# Altium schematic sheet EP3CE75F484.SchDoc
size A1
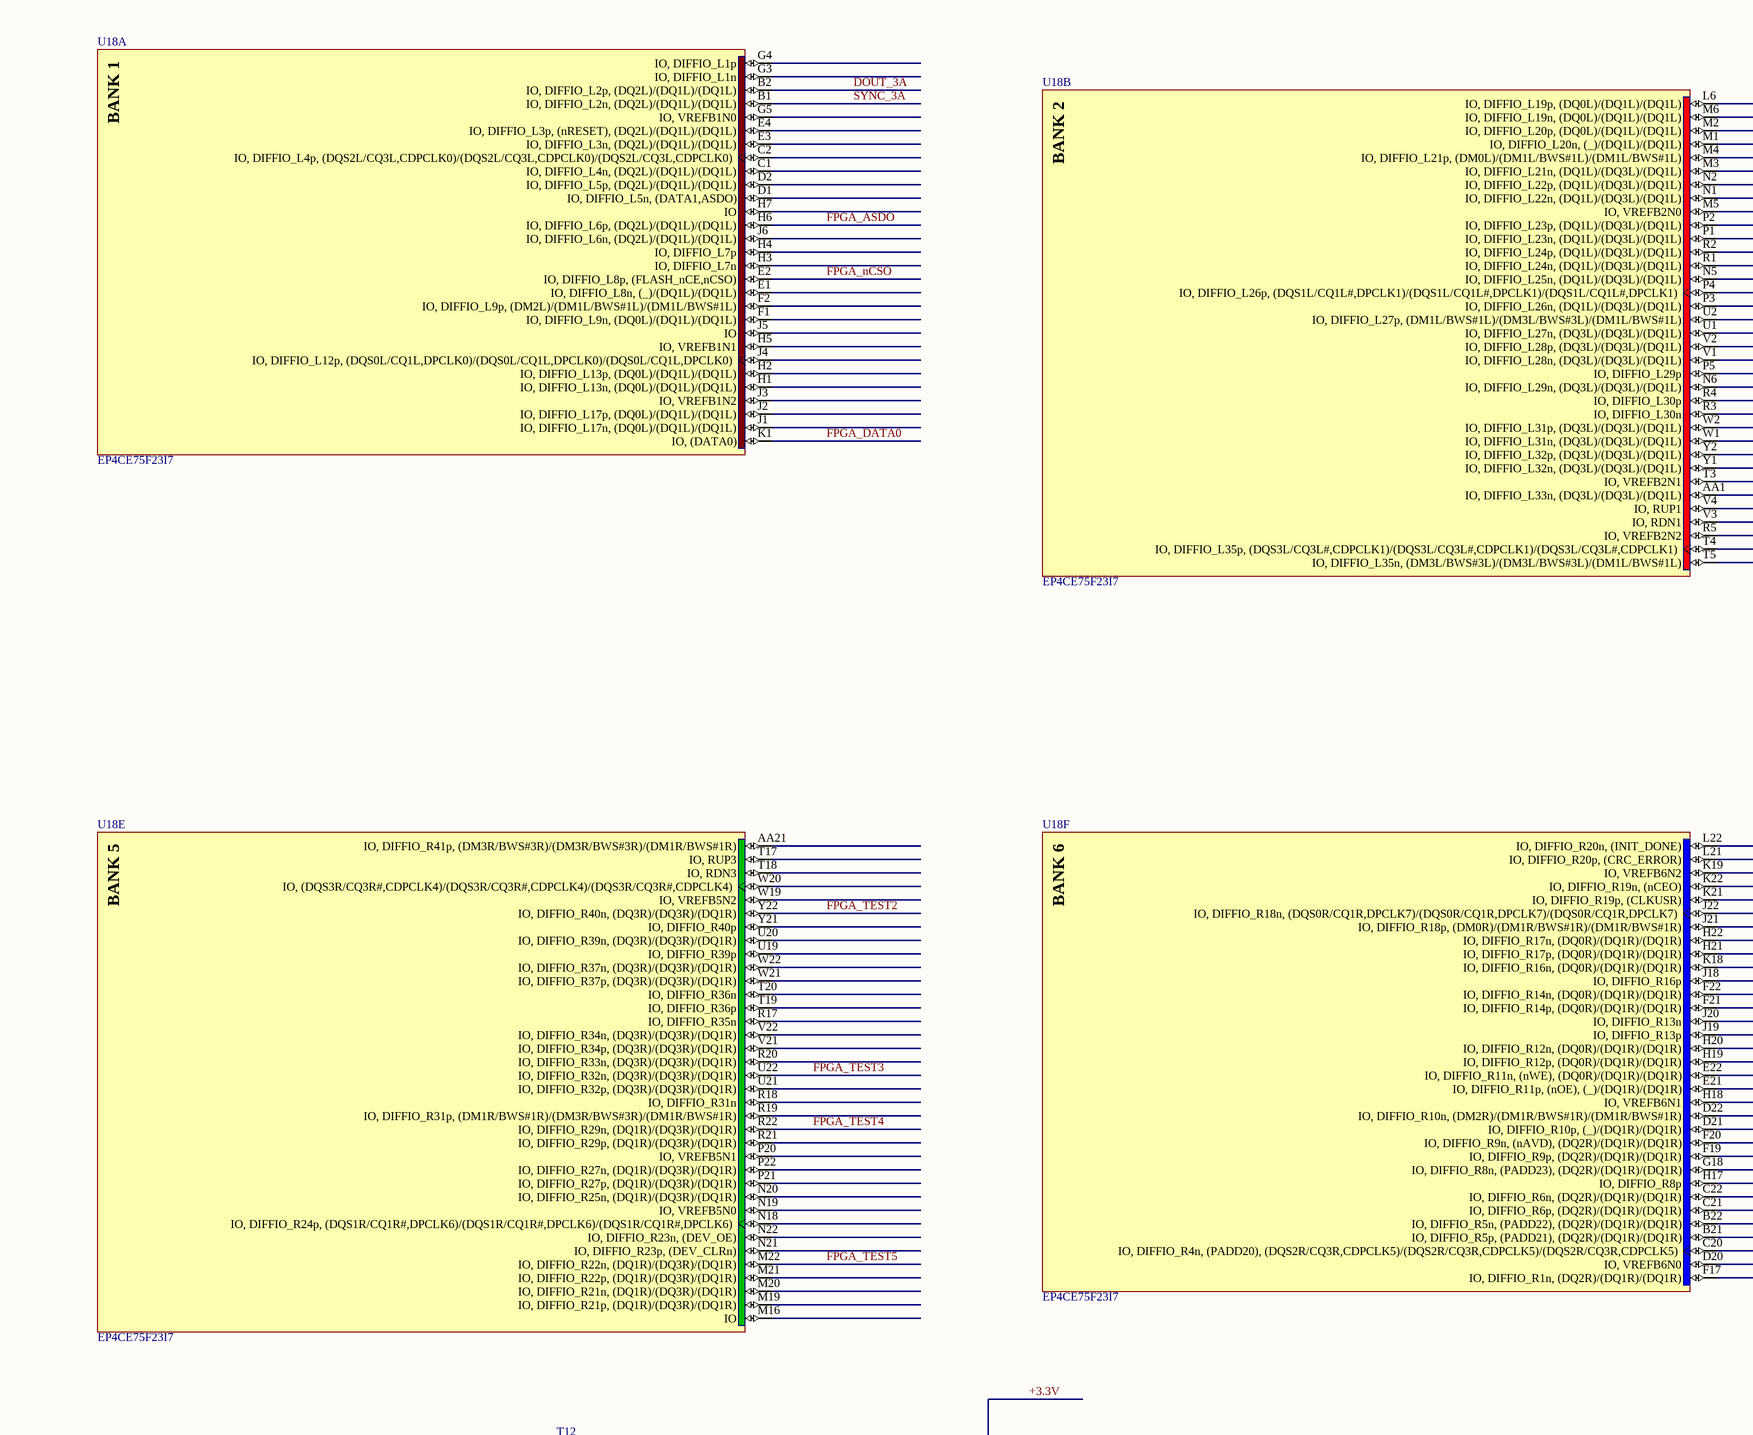
[diagram p0: EP3CE75F484.SchDoc, top left]
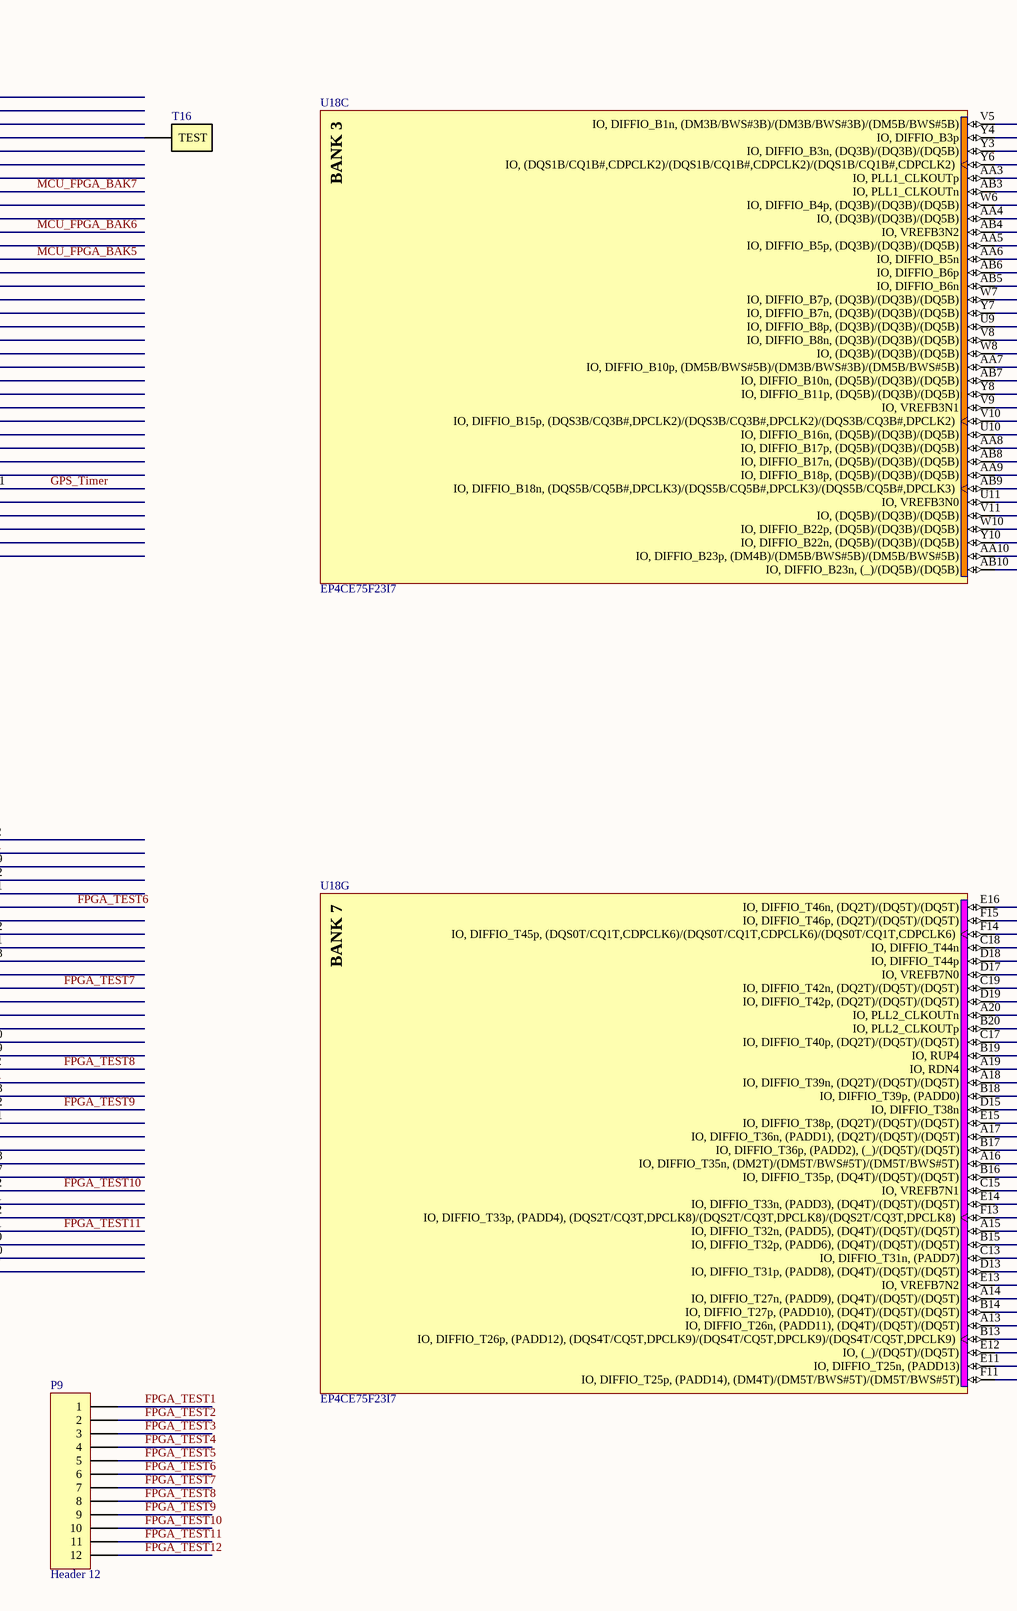
[diagram p1: EP3CE75F484.SchDoc, top middle]
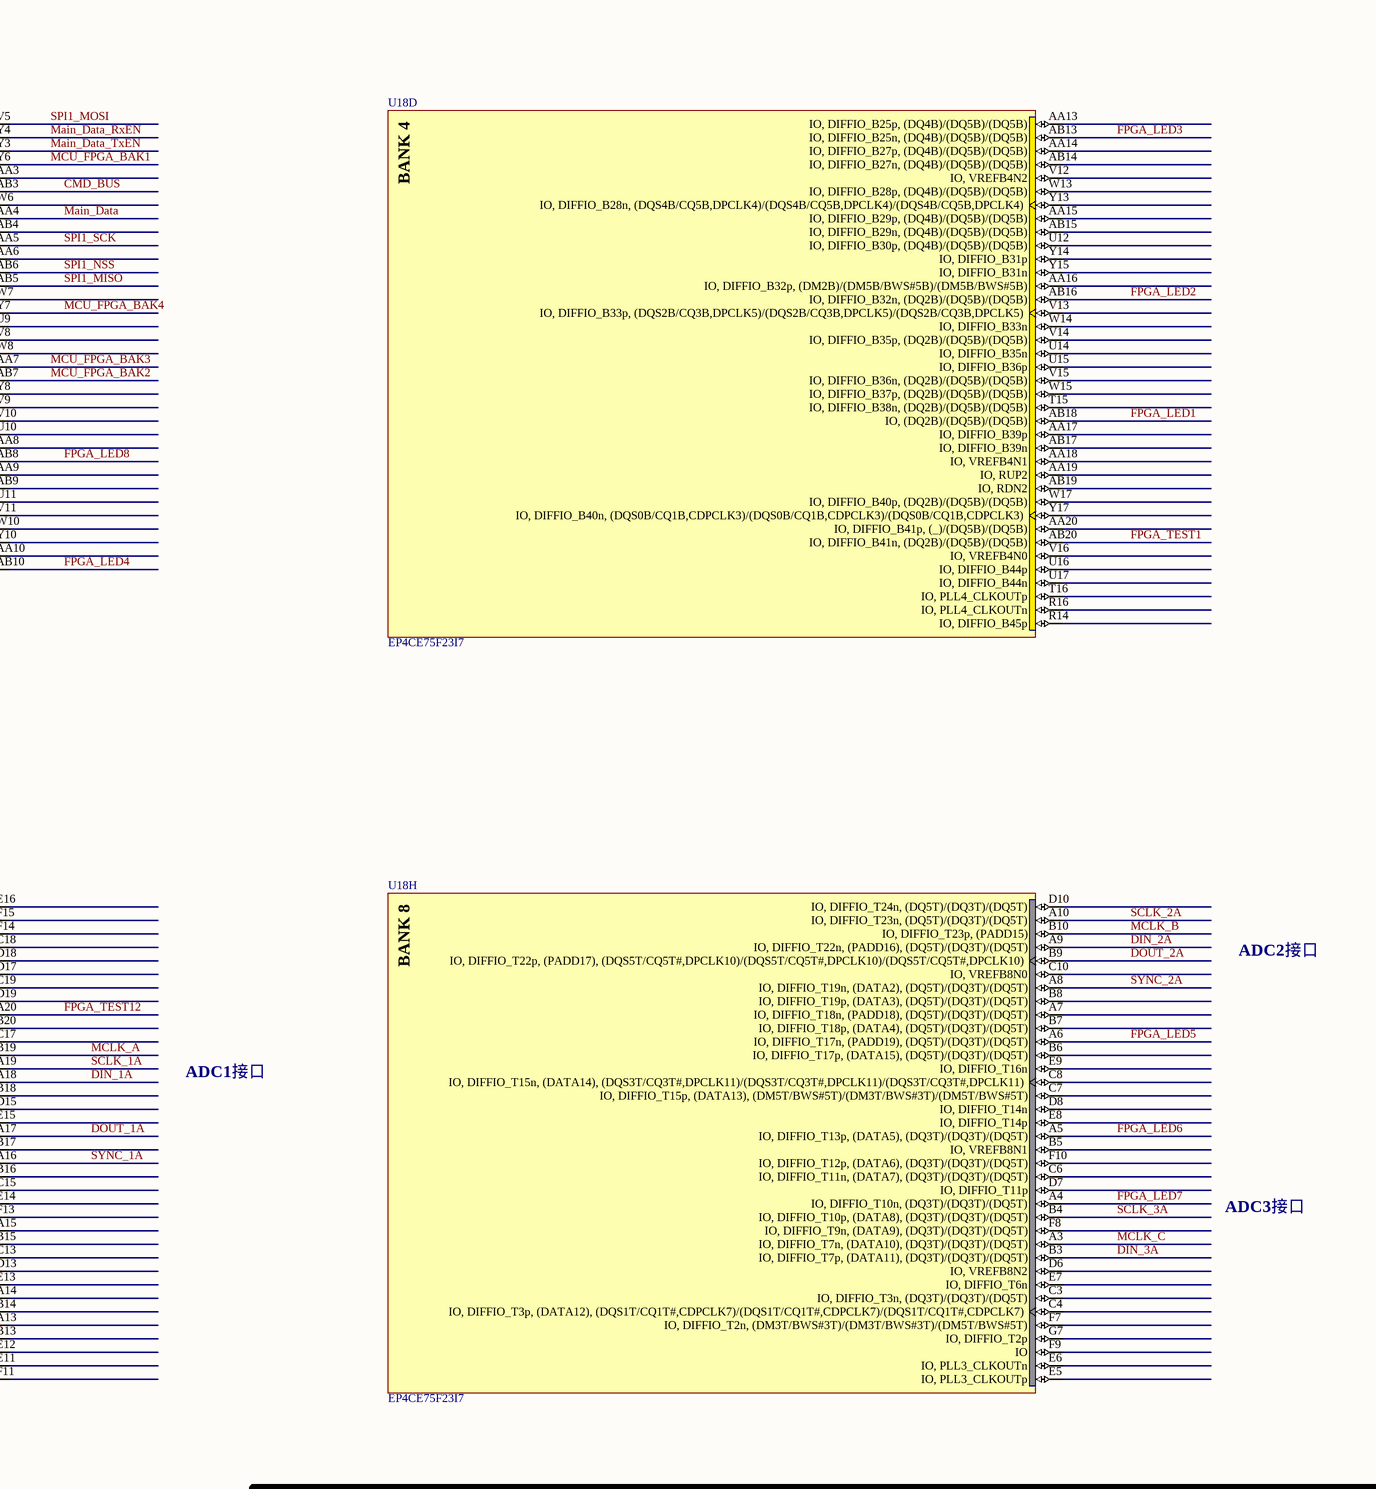
[diagram p2: EP3CE75F484.SchDoc, top right]
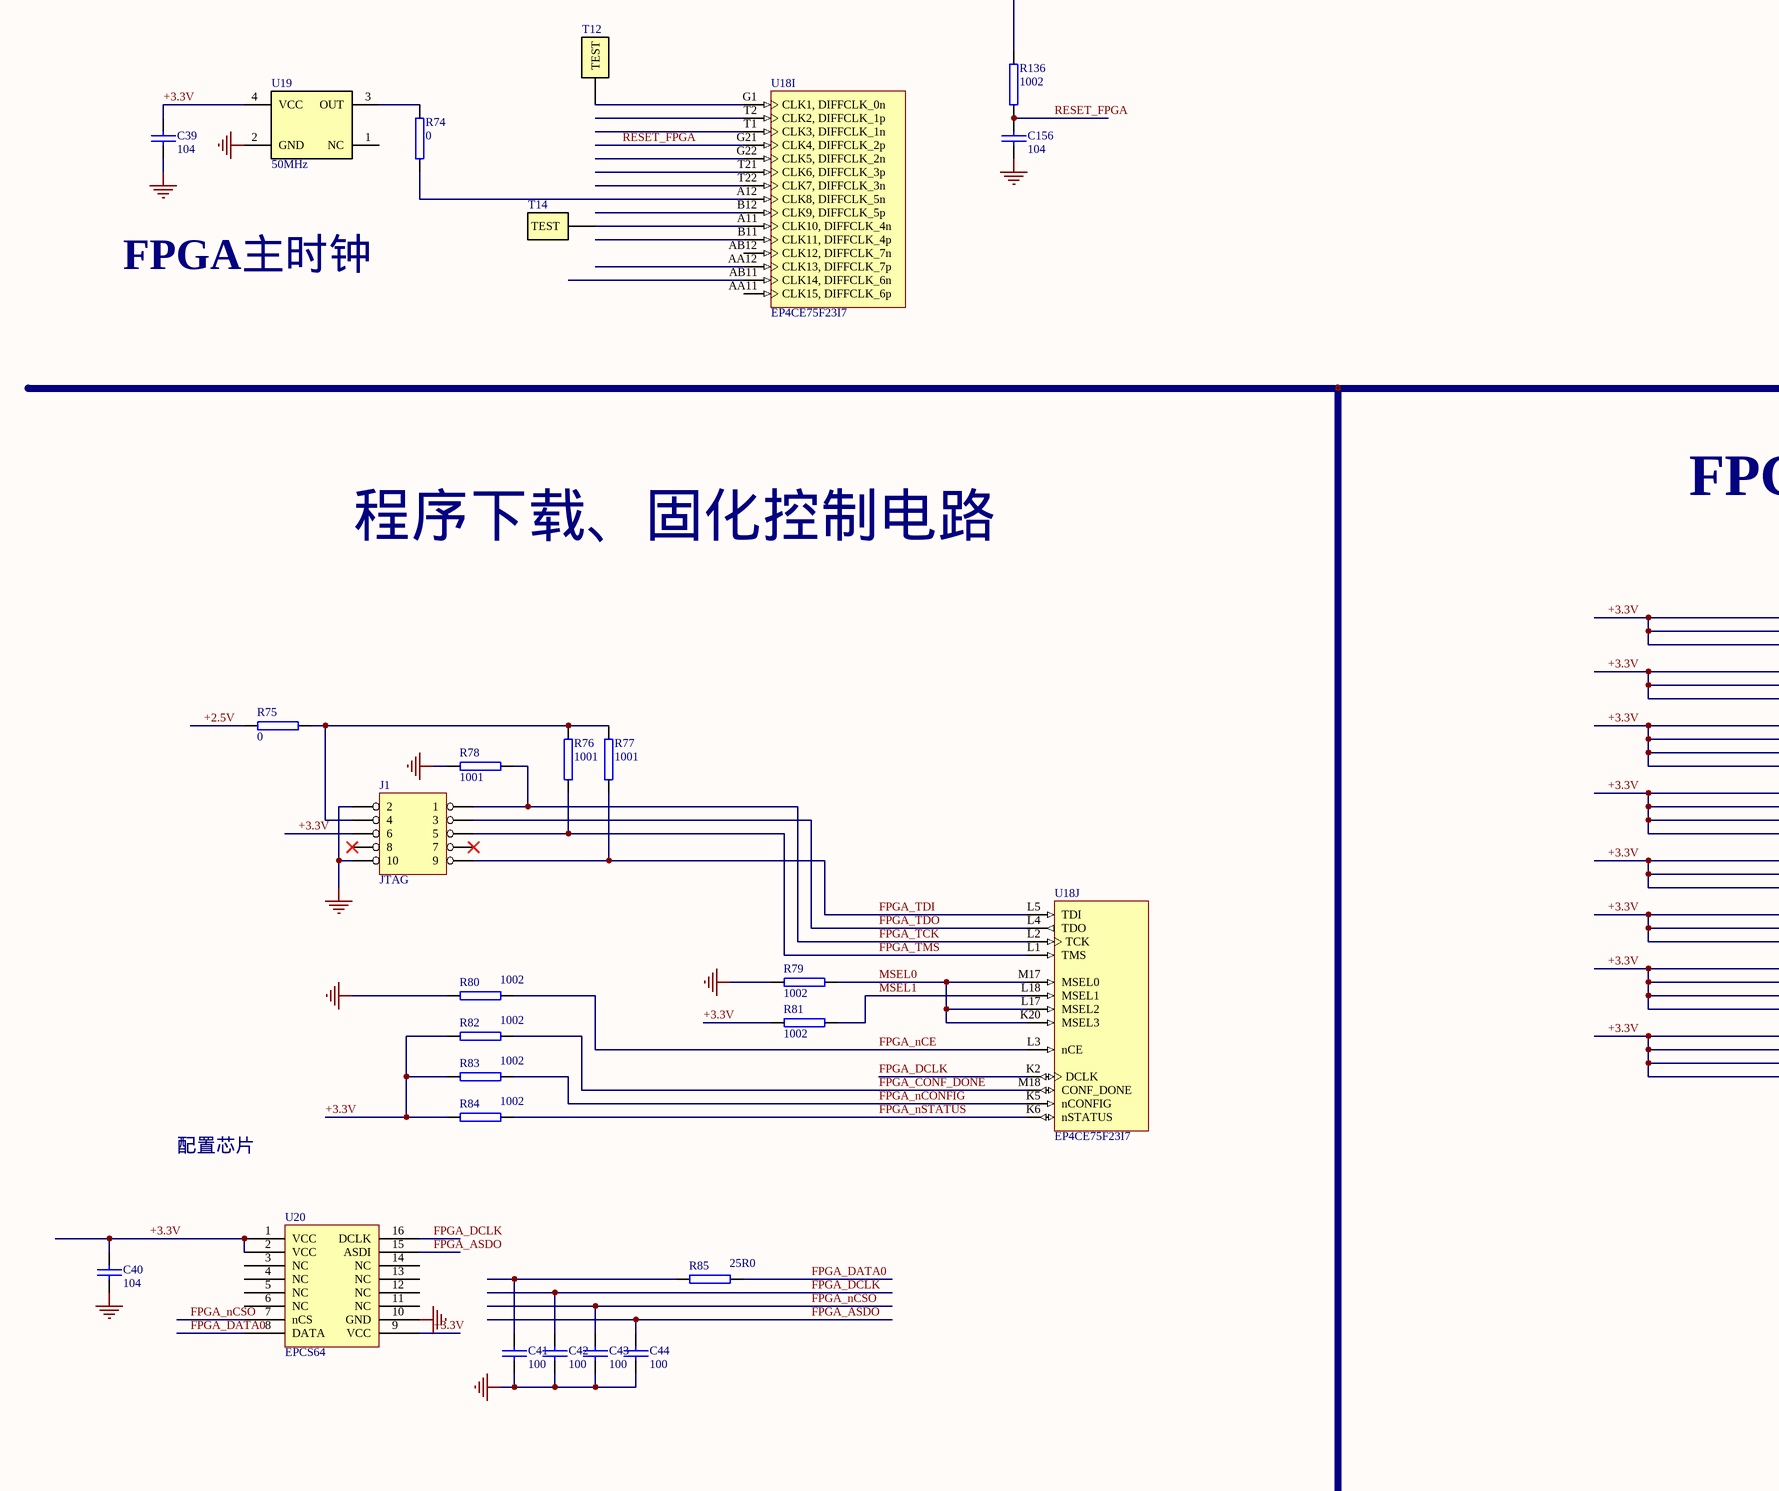
[diagram p3: EP3CE75F484.SchDoc, bottom left]
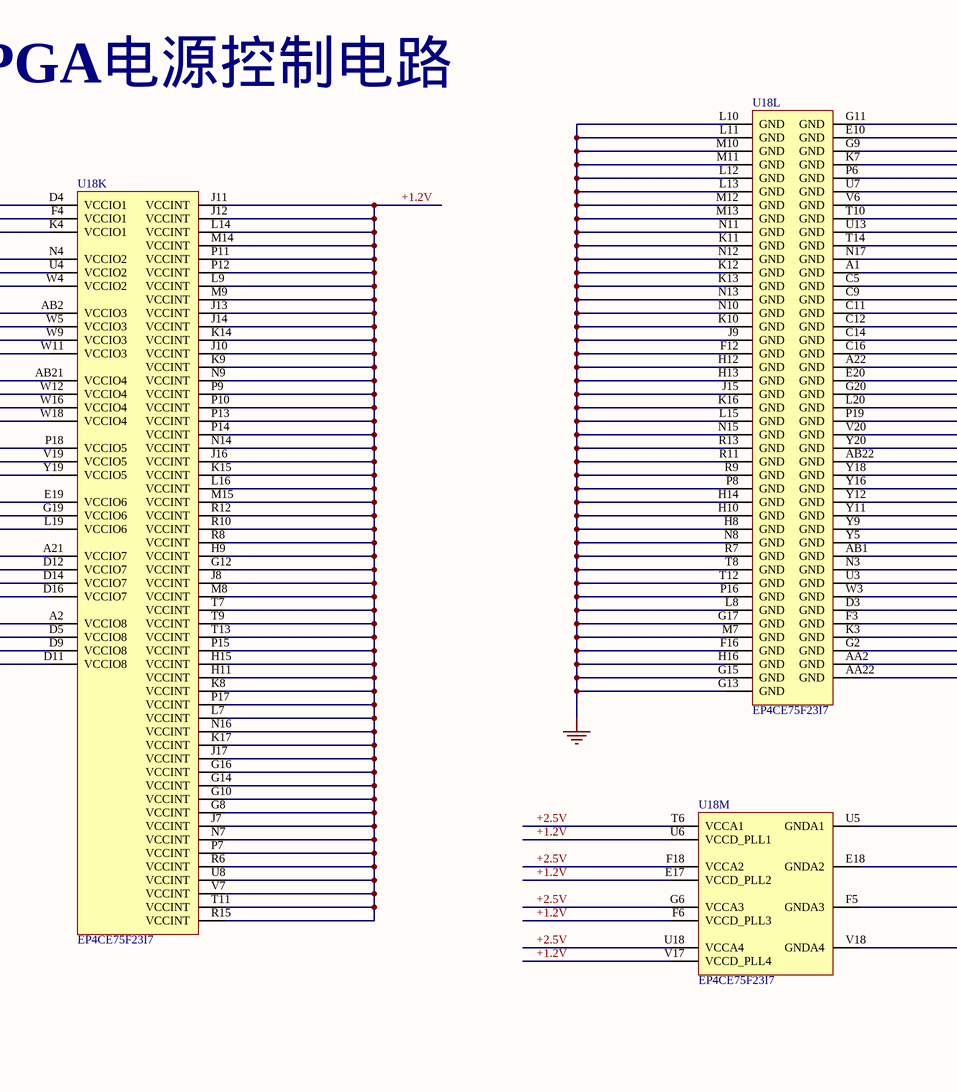
[diagram p4: EP3CE75F484.SchDoc, bottom middle]
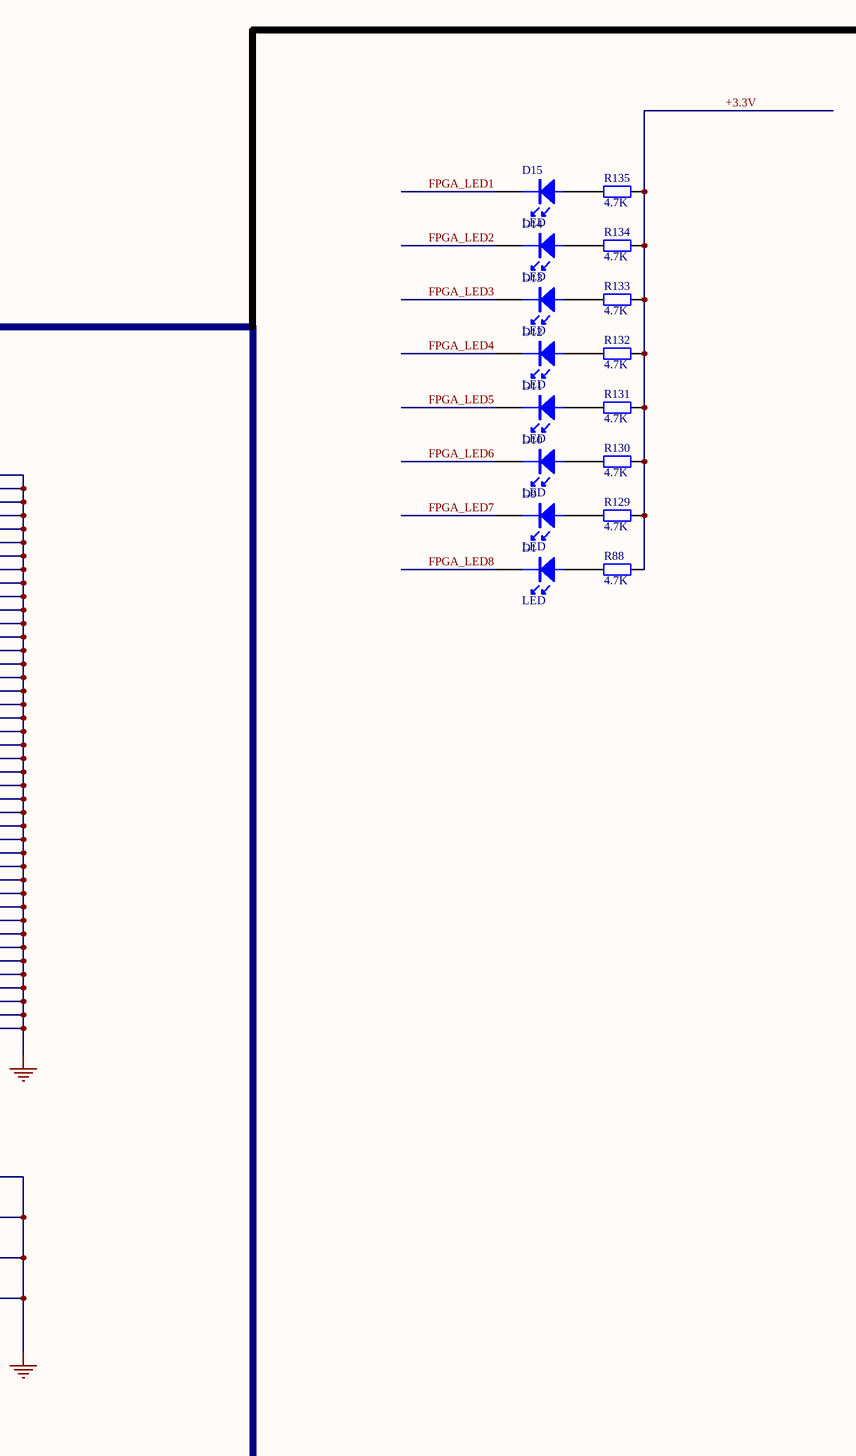
[diagram p5: EP3CE75F484.SchDoc, bottom right]

## Parts
C39  104  [0603]
C40  104  [0603]
C41  100  [0603]
C42  100  [0603]
C43  100  [0603]
C44  100  [0603]
C156  104  [0603]
D1  LED  [0805_LED]
D9  LED  [0805_LED]
D10  LED  [0805_LED]
D11  LED  [0805_LED]
D12  LED  [0805_LED]
D13  LED  [0805_LED]
D14  LED  [0805_LED]
D15  LED  [0805_LED]
J1  JTAG  [IDC10]
P9  Header 12  [HDR1X12]
R74  0  [0603]
R75  0  [0603]
R76  1001  [0603]
R77  1001  [0603]
R78  1001  [0603]
R79  1002  [0603]
R80  1002  [0603]
R81  1002  [0603]
R82  1002  [0603]
R83  1002  [0603]
R84  1002  [0603]
R85  25R0  [0603]
R88  value 4.7K  [0603]  (hidden comment: Res2)
R129  value 4.7K  [0603]  (hidden comment: Res2)
R130  value 4.7K  [0603]  (hidden comment: Res2)
R131  value 4.7K  [0603]  (hidden comment: Res2)
R132  value 4.7K  [0603]  (hidden comment: Res2)
R133  value 4.7K  [0603]  (hidden comment: Res2)
R134  value 4.7K  [0603]  (hidden comment: Res2)
R135  value 4.7K  [0603]  (hidden comment: Res2)
R136  1002  [0603]
T12  (no value)  [TEST]
T14  (no value)  [TEST]
T16  (no value)  [TEST]
U18  EP4CE75F23I7  [FBGA484]  (parts A,B,C,D,E,F,G,H,I,J,K,L,M of 13)
U19  50MHz  [CLOCK4]
U20  EPCS64  [SOP65P780-16M]

## Nets
DGND: C39.1 C40.1 C41.1 C42.1 C43.1 C44.1 C156.1 J1.2 J1.10 R78.1 R79.1 R80.2 U18.A1(GND) U18.A22(GND) U18.AA2(GND) U18.AA22(GND) U18.AB1(GND) U18.AB22(GND) U18.C5(GND) U18.C9(GND) U18.C11(GND) U18.C12(GND) U18.C14(GND) U18.C16(GND) U18.D3(GND) U18.E10(GND) U18.E18(GNDA2) U18.E20(GND) U18.F3(GND) U18.F5(GNDA3) U18.F12(GND) U18.F16(GND) U18.G2(GND) U18.G9(GND) U18.G11(GND) U18.G13(GND) U18.G15(GND) U18.G17(GND) U18.G20(GND) U18.H8(GND) U18.H10(GND) U18.H12(GND) U18.H13(GND) U18.H14(GND) U18.H16(GND) U18.J9(GND) U18.J15(GND) U18.K3(GND) U18.K7(GND) U18.K10(GND) U18.K11(GND) U18.K12(GND) U18.K13(GND) U18.K16(GND) U18.L8(GND) U18.L10(GND) U18.L11(GND) U18.L12(GND) U18.L13(GND) U18.L15(GND) U18.L20(GND) U18.M7(GND) U18.M10(GND) U18.M11(GND) U18.M12(GND) U18.M13(GND) U18.N3(GND) U18.N8(GND) U18.N10(GND) U18.N11(GND) U18.N12(GND) U18.N13(GND) U18.N15(GND) U18.N17(GND) U18.P6(GND) U18.P8(GND) U18.P16(GND) U18.P19(GND) U18.R7(GND) U18.R9(GND) U18.R11(GND) U18.R13(GND) U18.T8(GND) U18.T10(GND) U18.T12(GND) U18.T14(GND) U18.U3(GND) U18.U5(GNDA1) U18.U7(GND) U18.U13(GND) U18.V6(GND) U18.V18(GNDA4) U18.V20(GND) U18.W3(GND) U18.Y5(GND) U18.Y9(GND) U18.Y11(GND) U18.Y12(GND) U18.Y16(GND) U18.Y18(GND) U18.Y20(GND) U19.2(GND) U20.10(GND)
+1.2V: U18.E17(VCCD_PLL2) U18.F6(VCCD_PLL3) U18.G8(VCCINT) U18.G10(VCCINT) U18.G12(VCCINT) U18.G14(VCCINT) U18.G16(VCCINT) U18.H9(VCCINT) U18.H11(VCCINT) U18.H15(VCCINT) U18.J7(VCCINT) U18.J8(VCCINT) U18.J10(VCCINT) U18.J11(VCCINT) U18.J12(VCCINT) U18.J13(VCCINT) U18.J14(VCCINT) U18.J16(VCCINT) U18.J17(VCCINT) U18.K8(VCCINT) U18.K9(VCCINT) U18.K14(VCCINT) U18.K15(VCCINT) U18.K17(VCCINT) U18.L7(VCCINT) U18.L9(VCCINT) U18.L14(VCCINT) U18.L16(VCCINT) U18.M8(VCCINT) U18.M9(VCCINT) U18.M14(VCCINT) U18.M15(VCCINT) U18.N7(VCCINT) U18.N9(VCCINT) U18.N14(VCCINT) U18.N16(VCCINT) U18.P7(VCCINT) U18.P9(VCCINT) U18.P10(VCCINT) U18.P11(VCCINT) U18.P12(VCCINT) U18.P13(VCCINT) U18.P14(VCCINT) U18.P15(VCCINT) U18.P17(VCCINT) U18.R6(VCCINT) U18.R8(VCCINT) U18.R10(VCCINT) U18.R12(VCCINT) U18.R15(VCCINT) U18.T7(VCCINT) U18.T9(VCCINT) U18.T11(VCCINT) U18.T13(VCCINT) U18.U6(VCCD_PLL1) U18.U8(VCCINT) U18.V7(VCCINT) U18.V17(VCCD_PLL4)
+2.5V: R75.1 U18.F18(VCCA2) U18.G6(VCCA3) U18.T6(VCCA1) U18.U18(VCCA4)
+3.3V: C39.2 C40.2 J1.6 R81.1 R82.1 R83.2 R84.2 R88.2 R129.2 R130.2 R131.2 R132.2 R133.2 R134.2 R135.2 R136.2 U18.A2(VCCIO8) U18.A21(VCCIO7) U18.AB2(VCCIO3) U18.AB21(VCCIO4) U18.D4(VCCIO1) U18.D5(VCCIO8) U18.D9(VCCIO8) U18.D11(VCCIO8) U18.D12(VCCIO7) U18.D14(VCCIO7) U18.D16(VCCIO7) U18.E19(VCCIO6) U18.F4(VCCIO1) U18.G19(VCCIO6) U18.K4(VCCIO1) U18.L19(VCCIO6) U18.N4(VCCIO2) U18.P18(VCCIO5) U18.U4(VCCIO2) U18.V19(VCCIO5) U18.W4(VCCIO2) U18.W5(VCCIO3) U18.W9(VCCIO3) U18.W11(VCCIO3) U18.W12(VCCIO4) U18.W16(VCCIO4) U18.W18(VCCIO4) U18.Y19(VCCIO5) U19.4(VCC) U20.1(VCC) U20.2(VCC) U20.9(VCC)
CMD_BUS: U18.AB3(IO,_PLL1_CLKOUTn)
DIN_1A: U18.A18(IO,_DIFFIO_T39n,_(DQ2T)/(DQ5T)/(DQ5T))
DIN_2A: U18.A9(IO,_DIFFIO_T22n,_(PADD16),_(DQ5T)/(DQ3T)/(DQ5T))
DIN_3A: U18.B3(IO,_DIFFIO_T7p,_(DATA11),_(DQ3T)/(DQ3T)/(DQ5T))
DOUT_1A: U18.A17(IO,_DIFFIO_T36n,_(PADD1),_(DQ2T)/(DQ5T)/(DQ5T))
DOUT_2A: U18.B9(IO,_DIFFIO_T22p,_(PADD17),_(DQS5T/CQ5T#,DPCLK10)/(DQS5T/CQ5T#,DPCLK10)/(DQS5T/CQ5T#,DPCLK10))
DOUT_3A: U18.B2(IO,_DIFFIO_L2p,_(DQ2L)/(DQ1L)/(DQ1L))
FPGA_ASDO: C44.2 U18.H6(IO,_DIFFIO_L6p,_(DQ2L)/(DQ1L)/(DQ1L)) U20.15(ASDI)
FPGA_CONF_DONE: R82.2 U18.M18(CONF_DONE)
FPGA_DATA0: R85.1 U18.K1(IO,_(DATA0)) U20.8(DATA)
FPGA_DCLK: C42.2 U18.K2(DCLK) U20.16(DCLK)
FPGA_LED1: D15.2(K) U18.AB18(IO,_(DQ2B)/(DQ5B)/(DQ5B))
FPGA_LED2: D14.2(K) U18.AB16(IO,_DIFFIO_B32n,_(DQ2B)/(DQ5B)/(DQ5B))
FPGA_LED3: D13.2(K) U18.AB13(IO,_DIFFIO_B25n,_(DQ4B)/(DQ5B)/(DQ5B))
FPGA_LED4: D12.2(K) U18.AB10(IO,_DIFFIO_B23n,_(_)/(DQ5B)/(DQ5B))
FPGA_LED5: D11.2(K) U18.A6(IO,_DIFFIO_T17n,_(PADD19),_(DQ5T)/(DQ3T)/(DQ5T))
FPGA_LED6: D10.2(K) U18.A5(IO,_DIFFIO_T13p,_(DATA5),_(DQ3T)/(DQ3T)/(DQ5T))
FPGA_LED7: D9.2(K) U18.A4(IO,_DIFFIO_T10n,_(DQ3T)/(DQ3T)/(DQ5T))
FPGA_LED8: D1.2(K) U18.AB8(IO,_DIFFIO_B17n,_(DQ5B)/(DQ3B)/(DQ5B))
FPGA_nCE: R80.1 U18.L3(nCE)
FPGA_nCONFIG: R83.1 U18.K5(nCONFIG)
FPGA_nCSO: C43.2 U18.E2(IO,_DIFFIO_L8p,_(FLASH_nCE,nCSO)) U20.7(nCS)
FPGA_nSTATUS: R84.1 U18.K6(nSTATUS)
FPGA_TCK: J1.1 R78.2 U18.L2(TCK)
FPGA_TDI: J1.9 R77.1 U18.L5(TDI)
FPGA_TDO: J1.3 U18.L4(TDO)
FPGA_TEST1: P9.1 U18.AB20(IO,_DIFFIO_B41n,_(DQ2B)/(DQ5B)/(DQ5B))
FPGA_TEST2: P9.2 U18.Y22(IO,_DIFFIO_R40n,_(DQ3R)/(DQ3R)/(DQ1R))
FPGA_TEST3: P9.3 U18.U22(IO,_DIFFIO_R32n,_(DQ3R)/(DQ3R)/(DQ1R))
FPGA_TEST4: P9.4 U18.R22(IO,_DIFFIO_R29n,_(DQ1R)/(DQ3R)/(DQ1R))
FPGA_TEST5: P9.5 U18.M22(IO,_DIFFIO_R22n,_(DQ1R)/(DQ3R)/(DQ1R))
FPGA_TEST6: P9.6 U18.J22(IO,_DIFFIO_R18n,_(DQS0R/CQ1R,DPCLK7)/(DQS0R/CQ1R,DPCLK7)/(DQS0R/CQ1R,DPCLK7))
FPGA_TEST7: P9.7 U18.F22(IO,_DIFFIO_R14n,_(DQ0R)/(DQ1R)/(DQ1R))
FPGA_TEST8: P9.8 U18.E22(IO,_DIFFIO_R11n,_(nWE),_(DQ0R)/(DQ1R)/(DQ1R))
FPGA_TEST9: P9.9 U18.D22(IO,_DIFFIO_R10n,_(DM2R)/(DM1R/BWS#1R)/(DM1R/BWS#1R))
FPGA_TEST10: P9.10 U18.C22(IO,_DIFFIO_R6n,_(DQ2R)/(DQ1R)/(DQ1R))
FPGA_TEST11: P9.11 U18.B21(IO,_DIFFIO_R5p,_(PADD21),_(DQ2R)/(DQ1R)/(DQ1R))
FPGA_TEST12: P9.12 U18.A20(IO,_PLL2_CLKOUTn)
FPGA_TMS: J1.5 R76.1 U18.L1(TMS)
GPS_Timer: U18.AA1(IO,_DIFFIO_L33n,_(DQ3L)/(DQ3L)/(DQ1L))
Main_Data: U18.AA4(IO,_(DQ3B)/(DQ3B)/(DQ5B))
Main_Data_RxEN: U18.Y4(IO,_DIFFIO_B3p)
Main_Data_TxEN: U18.Y3(IO,_DIFFIO_B3n,_(DQ3B)/(DQ3B)/(DQ5B))
MCLK_A: U18.B19(IO,_RUP4)
MCLK_B: U18.B10(IO,_DIFFIO_T23p,_(PADD15))
MCLK_C: U18.A3(IO,_DIFFIO_T7n,_(DATA10),_(DQ3T)/(DQ3T)/(DQ5T))
MCU_FPGA_BAK1: U18.Y6(IO,_(DQS1B/CQ1B#,CDPCLK2)/(DQS1B/CQ1B#,CDPCLK2)/(DQS1B/CQ1B#,CDPCLK2))
MCU_FPGA_BAK2: U18.AB7(IO,_DIFFIO_B10n,_(DQ5B)/(DQ3B)/(DQ5B))
MCU_FPGA_BAK3: U18.AA7(IO,_DIFFIO_B10p,_(DM5B/BWS#5B)/(DM3B/BWS#3B)/(DM5B/BWS#5B))
MCU_FPGA_BAK4: U18.Y7(IO,_DIFFIO_B7n,_(DQ3B)/(DQ3B)/(DQ5B))
MCU_FPGA_BAK5: U18.R1(IO,_DIFFIO_L24n,_(DQ1L)/(DQ3L)/(DQ1L))
MCU_FPGA_BAK6: U18.P1(IO,_DIFFIO_L23n,_(DQ1L)/(DQ3L)/(DQ1L))
MCU_FPGA_BAK7: U18.N1(IO,_DIFFIO_L22n,_(DQ1L)/(DQ3L)/(DQ1L))
MSEL0: R79.2 U18.K20(MSEL3) U18.L17(MSEL2) U18.M17(MSEL0)
MSEL1: R81.2 U18.L18(MSEL1)
RESET_FPGA: C156.2 R136.1 U18.G21(CLK4,_DIFFCLK_2p)
SCLK_1A: U18.A19(IO,_RDN4)
SCLK_2A: U18.A10(IO,_DIFFIO_T23n,_(DQ5T)/(DQ3T)/(DQ5T))
SCLK_3A: U18.B4(IO,_DIFFIO_T10p,_(DATA8),_(DQ3T)/(DQ3T)/(DQ5T))
SPI1_MISO: U18.AB5(IO,_DIFFIO_B6n)
SPI1_MOSI: U18.V5(IO,_DIFFIO_B1n,_(DM3B/BWS#3B)/(DM3B/BWS#3B)/(DM5B/BWS#5B))
SPI1_NSS: U18.AB6(IO,_DIFFIO_B6p)
SPI1_SCK: U18.AA5(IO,_DIFFIO_B5p,_(DQ3B)/(DQ3B)/(DQ5B))
SYNC_1A: U18.A16(IO,_DIFFIO_T35n,_(DM2T)/(DM5T/BWS#5T)/(DM5T/BWS#5T))
SYNC_2A: U18.A8(IO,_DIFFIO_T19n,_(DATA2),_(DQ5T)/(DQ3T)/(DQ5T))
SYNC_3A: U18.B1(IO,_DIFFIO_L2n,_(DQ2L)/(DQ1L)/(DQ1L))
NetC41_2: C41.2 R85.2
NetD1_1: D1.1(A) R88.1
NetD9_1: D9.1(A) R129.1
NetD10_1: D10.1(A) R130.1
NetD11_1: D11.1(A) R131.1
NetD12_1: D12.1(A) R132.1
NetD13_1: D13.1(A) R133.1
NetD14_1: D14.1(A) R134.1
NetD15_1: D15.1(A) R135.1
NetJ1_4: J1.4 R75.2 R76.2 R77.2
NetR74_1: R74.1 U19.3(OUT)
NetR74_2: R74.2 U18.A12(CLK8,_DIFFCLK_5n)
NetT12_1: T12.1(TEST) U18.G1(CLK1,_DIFFCLK_0n)
NetT14_1: T14.1(TEST) U18.A11(CLK10,_DIFFCLK_4n)
NetT16_1: T16.1(TEST) U18.M1(IO,_DIFFIO_L20n,_(_)/(DQ1L)/(DQ1L))

Not connected (* = marked no-connect by the designer): J1 7* 8*; U18 A7(IO,_DIFFIO_T18n,_(PADD18),_(DQ5T)/(DQ3T)/(DQ5T)) A13(IO,_DIFFIO_T26n,_(PADD11),_(DQ4T)/(DQ5T)/(DQ5T)) A14(IO,_DIFFIO_T27n,_(PADD9),_(DQ4T)/(DQ5T)/(DQ5T)) A15(IO,_DIFFIO_T32n,_(PADD5),_(DQ4T)/(DQ5T)/(DQ5T)) AA3(IO,_PLL1_CLKOUTp) AA6(IO,_DIFFIO_B5n) AA8(IO,_DIFFIO_B17p,_(DQ5B)/(DQ3B)/(DQ5B)) AA9(IO,_DIFFIO_B18p,_(DQ5B)/(DQ3B)/(DQ5B)) AA10(IO,_DIFFIO_B23p,_(DM4B)/(DM5B/BWS#5B)/(DM5B/BWS#5B)) AA11(CLK15,_DIFFCLK_6p) AA12(CLK13,_DIFFCLK_7p) AA13(IO,_DIFFIO_B25p,_(DQ4B)/(DQ5B)/(DQ5B)) AA14(IO,_DIFFIO_B27p,_(DQ4B)/(DQ5B)/(DQ5B)) AA15(IO,_DIFFIO_B29p,_(DQ4B)/(DQ5B)/(DQ5B)) AA16(IO,_DIFFIO_B32p,_(DM2B)/(DM5B/BWS#5B)/(DM5B/BWS#5B)) AA17(IO,_DIFFIO_B39p) AA18(IO,_VREFB4N1) AA19(IO,_RUP2) AA20(IO,_DIFFIO_B41p,_(_)/(DQ5B)/(DQ5B)) AA21(IO,_DIFFIO_R41p,_(DM3R/BWS#3R)/(DM3R/BWS#3R)/(DM1R/BWS#1R)) AB4(IO,_VREFB3N2) AB9(IO,_DIFFIO_B18n,_(DQS5B/CQ5B#,DPCLK3)/(DQS5B/CQ5B#,DPCLK3)/(DQS5B/CQ5B#,DPCLK3)) AB11(CLK14,_DIFFCLK_6n) AB12(CLK12,_DIFFCLK_7n) AB14(IO,_DIFFIO_B27n,_(DQ4B)/(DQ5B)/(DQ5B)) AB15(IO,_DIFFIO_B29n,_(DQ4B)/(DQ5B)/(DQ5B)) AB17(IO,_DIFFIO_B39n) AB19(IO,_RDN2) B5(IO,_VREFB8N1) B6(IO,_DIFFIO_T17p,_(DATA15),_(DQ5T)/(DQ3T)/(DQ5T)) B7(IO,_DIFFIO_T18p,_(DATA4),_(DQ5T)/(DQ3T)/(DQ5T)) B8(IO,_DIFFIO_T19p,_(DATA3),_(DQ5T)/(DQ3T)/(DQ5T)) B11(CLK11,_DIFFCLK_4p) B12(CLK9,_DIFFCLK_5p) B13(IO,_DIFFIO_T26p,_(PADD12),_(DQS4T/CQ5T,DPCLK9)/(DQS4T/CQ5T,DPCLK9)/(DQS4T/CQ5T,DPCLK9)) B14(IO,_DIFFIO_T27p,_(PADD10),_(DQ4T)/(DQ5T)/(DQ5T)) B15(IO,_DIFFIO_T32p,_(PADD6),_(DQ4T)/(DQ5T)/(DQ5T)) B16(IO,_DIFFIO_T35p,_(DQ4T)/(DQ5T)/(DQ5T)) B17(IO,_DIFFIO_T36p,_(PADD2),_(_)/(DQ5T)/(DQ5T)) B18(IO,_DIFFIO_T39p,_(PADD0)) B20(IO,_PLL2_CLKOUTp) B22(IO,_DIFFIO_R5n,_(PADD22),_(DQ2R)/(DQ1R)/(DQ1R)) C1(IO,_DIFFIO_L4n,_(DQ2L)/(DQ1L)/(DQ1L)) C2(IO,_DIFFIO_L4p,_(DQS2L/CQ3L,CDPCLK0)/(DQS2L/CQ3L,CDPCLK0)/(DQS2L/CQ3L,CDPCLK0)) C3(IO,_DIFFIO_T3n,_(DQ3T)/(DQ3T)/(DQ5T)) C4(IO,_DIFFIO_T3p,_(DATA12),_(DQS1T/CQ1T#,CDPCLK7)/(DQS1T/CQ1T#,CDPCLK7)/(DQS1T/CQ1T#,CDPCLK7)) C6(IO,_DIFFIO_T11n,_(DATA7),_(DQ3T)/(DQ3T)/(DQ5T)) C7(IO,_DIFFIO_T15p,_(DATA13),_(DM5T/BWS#5T)/(DM3T/BWS#3T)/(DM5T/BWS#5T)) C8(IO,_DIFFIO_T15n,_(DATA14),_(DQS3T/CQ3T#,DPCLK11)/(DQS3T/CQ3T#,DPCLK11)/(DQS3T/CQ3T#,DPCLK11)) C10(IO,_VREFB8N0) C13(IO,_DIFFIO_T31n,_(PADD7)) C15(IO,_VREFB7N1) C17(IO,_DIFFIO_T40p,_(DQ2T)/(DQ5T)/(DQ5T)) C18(IO,_DIFFIO_T44n) C19(IO,_DIFFIO_T42n,_(DQ2T)/(DQ5T)/(DQ5T)) C20(IO,_DIFFIO_R4n,_(PADD20),_(DQS2R/CQ3R,CDPCLK5)/(DQS2R/CQ3R,CDPCLK5)/(DQS2R/CQ3R,CDPCLK5)) C21(IO,_DIFFIO_R6p,_(DQ2R)/(DQ1R)/(DQ1R)) D1(IO,_DIFFIO_L5n,_(DATA1,ASDO)) D2(IO,_DIFFIO_L5p,_(DQ2L)/(DQ1L)/(DQ1L)) D6(IO,_VREFB8N2) D7(IO,_DIFFIO_T11p) D8(IO,_DIFFIO_T14n) D10(IO,_DIFFIO_T24n,_(DQ5T)/(DQ3T)/(DQ5T)) D13(IO,_DIFFIO_T31p,_(PADD8),_(DQ4T)/(DQ5T)/(DQ5T)) D15(IO,_DIFFIO_T38n) D17(IO,_VREFB7N0) D18(IO,_DIFFIO_T44p) D19(IO,_DIFFIO_T42p,_(DQ2T)/(DQ5T)/(DQ5T)) D20(IO,_VREFB6N0) D21(IO,_DIFFIO_R10p,_(_)/(DQ1R)/(DQ1R)) E1(IO,_DIFFIO_L8n,_(_)/(DQ1L)/(DQ1L)) E3(IO,_DIFFIO_L3n,_(DQ2L)/(DQ1L)/(DQ1L)) E4(IO,_DIFFIO_L3p,_(nRESET),_(DQ2L)/(DQ1L)/(DQ1L)) E5(IO,_PLL3_CLKOUTp) E6(IO,_PLL3_CLKOUTn) E7(IO,_DIFFIO_T6n) E8(IO,_DIFFIO_T14p) E9(IO,_DIFFIO_T16n) E11(IO,_DIFFIO_T25n,_(PADD13)) E12(IO,_(_)/(DQ5T)/(DQ5T)) E13(IO,_VREFB7N2) E14(IO,_DIFFIO_T33n,_(PADD3),_(DQ4T)/(DQ5T)/(DQ5T)) E15(IO,_DIFFIO_T38p,_(DQ2T)/(DQ5T)/(DQ5T)) E16(IO,_DIFFIO_T46n,_(DQ2T)/(DQ5T)/(DQ5T)) E21(IO,_DIFFIO_R11p,_(nOE),_(_)/(DQ1R)/(DQ1R)) F1(IO,_DIFFIO_L9n,_(DQ0L)/(DQ1L)/(DQ1L)) F2(IO,_DIFFIO_L9p,_(DM2L)/(DM1L/BWS#1L)/(DM1L/BWS#1L)) F7(IO,_DIFFIO_T2n,_(DM3T/BWS#3T)/(DM3T/BWS#3T)/(DM5T/BWS#5T)) F8(IO,_DIFFIO_T9n,_(DATA9),_(DQ3T)/(DQ3T)/(DQ5T)) F9(IO) F10(IO,_DIFFIO_T12p,_(DATA6),_(DQ3T)/(DQ3T)/(DQ5T)) F11(IO,_DIFFIO_T25p,_(PADD14),_(DM4T)/(DM5T/BWS#5T)/(DM5T/BWS#5T)) F13(IO,_DIFFIO_T33p,_(PADD4),_(DQS2T/CQ3T,DPCLK8)/(DQS2T/CQ3T,DPCLK8)/(DQS2T/CQ3T,DPCLK8)) F14(IO,_DIFFIO_T45p,_(DQS0T/CQ1T,CDPCLK6)/(DQS0T/CQ1T,CDPCLK6)/(DQS0T/CQ1T,CDPCLK6)) F15(IO,_DIFFIO_T46p,_(DQ2T)/(DQ5T)/(DQ5T)) F17(IO,_DIFFIO_R1n,_(DQ2R)/(DQ1R)/(DQ1R)) F19(IO,_DIFFIO_R9p,_(DQ2R)/(DQ1R)/(DQ1R)) F20(IO,_DIFFIO_R9n,_(nAVD),_(DQ2R)/(DQ1R)/(DQ1R)) F21(IO,_DIFFIO_R14p,_(DQ0R)/(DQ1R)/(DQ1R)) G3(IO,_DIFFIO_L1n) G4(IO,_DIFFIO_L1p) G5(IO,_VREFB1N0) G7(IO,_DIFFIO_T2p) G18(IO,_DIFFIO_R8n,_(PADD23),_(DQ2R)/(DQ1R)/(DQ1R)) G22(CLK5,_DIFFCLK_2n) H1(IO,_DIFFIO_L13n,_(DQ0L)/(DQ1L)/(DQ1L)) H2(IO,_DIFFIO_L13p,_(DQ0L)/(DQ1L)/(DQ1L)) H3(IO,_DIFFIO_L7n) H4(IO,_DIFFIO_L7p) H5(IO,_VREFB1N1) H7(IO) H17(IO,_DIFFIO_R8p) H18(IO,_VREFB6N1) H19(IO,_DIFFIO_R12p,_(DQ0R)/(DQ1R)/(DQ1R)) H20(IO,_DIFFIO_R12n,_(DQ0R)/(DQ1R)/(DQ1R)) H21(IO,_DIFFIO_R17p,_(DQ0R)/(DQ1R)/(DQ1R)) H22(IO,_DIFFIO_R17n,_(DQ0R)/(DQ1R)/(DQ1R)) J1(IO,_DIFFIO_L17n,_(DQ0L)/(DQ1L)/(DQ1L)) J2(IO,_DIFFIO_L17p,_(DQ0L)/(DQ1L)/(DQ1L)) J3(IO,_VREFB1N2) J4(IO,_DIFFIO_L12p,_(DQS0L/CQ1L,DPCLK0)/(DQS0L/CQ1L,DPCLK0)/(DQS0L/CQ1L,DPCLK0)) J5(IO) J6(IO,_DIFFIO_L6n,_(DQ2L)/(DQ1L)/(DQ1L)) J18(IO,_DIFFIO_R16p) J19(IO,_DIFFIO_R13p) J20(IO,_DIFFIO_R13n) J21(IO,_DIFFIO_R18p,_(DM0R)/(DM1R/BWS#1R)/(DM1R/BWS#1R)) K18(IO,_DIFFIO_R16n,_(DQ0R)/(DQ1R)/(DQ1R)) K19(IO,_VREFB6N2) K21(IO,_DIFFIO_R19p,_(CLKUSR)) K22(IO,_DIFFIO_R19n,_(nCEO)) L6(IO,_DIFFIO_L19p,_(DQ0L)/(DQ1L)/(DQ1L)) L21(IO,_DIFFIO_R20p,_(CRC_ERROR)) L22(IO,_DIFFIO_R20n,_(INIT_DONE)) M2(IO,_DIFFIO_L20p,_(DQ0L)/(DQ1L)/(DQ1L)) M3(IO,_DIFFIO_L21n,_(DQ1L)/(DQ3L)/(DQ1L)) M4(IO,_DIFFIO_L21p,_(DM0L)/(DM1L/BWS#1L)/(DM1L/BWS#1L)) M5(IO,_VREFB2N0) M6(IO,_DIFFIO_L19n,_(DQ0L)/(DQ1L)/(DQ1L)) M16(IO) M19(IO,_DIFFIO_R21p,_(DQ1R)/(DQ3R)/(DQ1R)) M20(IO,_DIFFIO_R21n,_(DQ1R)/(DQ3R)/(DQ1R)) M21(IO,_DIFFIO_R22p,_(DQ1R)/(DQ3R)/(DQ1R)) N2(IO,_DIFFIO_L22p,_(DQ1L)/(DQ3L)/(DQ1L)) N5(IO,_DIFFIO_L25n,_(DQ1L)/(DQ3L)/(DQ1L)) N6(IO,_DIFFIO_L29n,_(DQ3L)/(DQ3L)/(DQ1L)) N18(IO,_DIFFIO_R24p,_(DQS1R/CQ1R#,DPCLK6)/(DQS1R/CQ1R#,DPCLK6)/(DQS1R/CQ1R#,DPCLK6)) N19(IO,_VREFB5N0) N20(IO,_DIFFIO_R25n,_(DQ1R)/(DQ3R)/(DQ1R)) N21(IO,_DIFFIO_R23p,_(DEV_CLRn)) N22(IO,_DIFFIO_R23n,_(DEV_OE)) P2(IO,_DIFFIO_L23p,_(DQ1L)/(DQ3L)/(DQ1L)) P3(IO,_DIFFIO_L26n,_(DQ1L)/(DQ3L)/(DQ1L)) P4(IO,_DIFFIO_L26p,_(DQS1L/CQ1L#,DPCLK1)/(DQS1L/CQ1L#,DPCLK1)/(DQS1L/CQ1L#,DPCLK1)) P5(IO,_DIFFIO_L29p) P20(IO,_VREFB5N1) P21(IO,_DIFFIO_R27p,_(DQ1R)/(DQ3R)/(DQ1R)) P22(IO,_DIFFIO_R27n,_(DQ1R)/(DQ3R)/(DQ1R)) R2(IO,_DIFFIO_L24p,_(DQ1L)/(DQ3L)/(DQ1L)) R3(IO,_DIFFIO_L30n) R4(IO,_DIFFIO_L30p) R5(IO,_VREFB2N2) R14(IO,_DIFFIO_B45p) R16(IO,_PLL4_CLKOUTn) R17(IO,_DIFFIO_R35n) R18(IO,_DIFFIO_R31n) R19(IO,_DIFFIO_R31p,_(DM1R/BWS#1R)/(DM3R/BWS#3R)/(DM1R/BWS#1R)) R20(IO,_DIFFIO_R33n,_(DQ3R)/(DQ3R)/(DQ1R)) R21(IO,_DIFFIO_R29p,_(DQ1R)/(DQ3R)/(DQ1R)) T1(CLK3,_DIFFCLK_1n) T2(CLK2,_DIFFCLK_1p) T3(IO,_VREFB2N1) T4(IO,_DIFFIO_L35p,_(DQS3L/CQ3L#,CDPCLK1)/(DQS3L/CQ3L#,CDPCLK1)/(DQS3L/CQ3L#,CDPCLK1)) T5(IO,_DIFFIO_L35n,_(DM3L/BWS#3L)/(DM3L/BWS#3L)/(DM1L/BWS#1L)) T15(IO,_DIFFIO_B38n,_(DQ2B)/(DQ5B)/(DQ5B)) T16(IO,_PLL4_CLKOUTp) T17(IO,_RUP3) T18(IO,_RDN3) T19(IO,_DIFFIO_R36p) T20(IO,_DIFFIO_R36n) T21(CLK6,_DIFFCLK_3p) T22(CLK7,_DIFFCLK_3n) U1(IO,_DIFFIO_L27n,_(DQ3L)/(DQ3L)/(DQ1L)) U2(IO,_DIFFIO_L27p,_(DM1L/BWS#1L)/(DM3L/BWS#3L)/(DM1L/BWS#1L)) U9(IO,_DIFFIO_B8p,_(DQ3B)/(DQ3B)/(DQ5B)) U10(IO,_DIFFIO_B16n,_(DQ5B)/(DQ3B)/(DQ5B)) U11(IO,_VREFB3N0) U12(IO,_DIFFIO_B30p,_(DQ4B)/(DQ5B)/(DQ5B)) U14(IO,_DIFFIO_B35n) U15(IO,_DIFFIO_B36p) U16(IO,_DIFFIO_B44p) U17(IO,_DIFFIO_B44n) U19(IO,_DIFFIO_R39p) U20(IO,_DIFFIO_R39n,_(DQ3R)/(DQ3R)/(DQ1R)) U21(IO,_DIFFIO_R32p,_(DQ3R)/(DQ3R)/(DQ1R)) V1(IO,_DIFFIO_L28n,_(DQ3L)/(DQ3L)/(DQ1L)) V2(IO,_DIFFIO_L28p,_(DQ3L)/(DQ3L)/(DQ1L)) V3(IO,_RDN1) V4(IO,_RUP1) V8(IO,_DIFFIO_B8n,_(DQ3B)/(DQ3B)/(DQ5B)) V9(IO,_VREFB3N1) V10(IO,_DIFFIO_B15p,_(DQS3B/CQ3B#,DPCLK2)/(DQS3B/CQ3B#,DPCLK2)/(DQS3B/CQ3B#,DPCLK2)) V11(IO,_(DQ5B)/(DQ3B)/(DQ5B)) V12(IO,_VREFB4N2) V13(IO,_DIFFIO_B33p,_(DQS2B/CQ3B,DPCLK5)/(DQS2B/CQ3B,DPCLK5)/(DQS2B/CQ3B,DPCLK5)) V14(IO,_DIFFIO_B35p,_(DQ2B)/(DQ5B)/(DQ5B)) V15(IO,_DIFFIO_B36n,_(DQ2B)/(DQ5B)/(DQ5B)) V16(IO,_VREFB4N0) V21(IO,_DIFFIO_R34p,_(DQ3R)/(DQ3R)/(DQ1R)) V22(IO,_DIFFIO_R34n,_(DQ3R)/(DQ3R)/(DQ1R)) W1(IO,_DIFFIO_L31n,_(DQ3L)/(DQ3L)/(DQ1L)) W2(IO,_DIFFIO_L31p,_(DQ3L)/(DQ3L)/(DQ1L)) W6(IO,_DIFFIO_B4p,_(DQ3B)/(DQ3B)/(DQ5B)) W7(IO,_DIFFIO_B7p,_(DQ3B)/(DQ3B)/(DQ5B)) W8(IO,_(DQ3B)/(DQ3B)/(DQ5B)) W10(IO,_DIFFIO_B22p,_(DQ5B)/(DQ3B)/(DQ5B)) W13(IO,_DIFFIO_B28p,_(DQ4B)/(DQ5B)/(DQ5B)) W14(IO,_DIFFIO_B33n) W15(IO,_DIFFIO_B37p,_(DQ2B)/(DQ5B)/(DQ5B)) W17(IO,_DIFFIO_B40p,_(DQ2B)/(DQ5B)/(DQ5B)) W19(IO,_VREFB5N2) W20(IO,_(DQS3R/CQ3R#,CDPCLK4)/(DQS3R/CQ3R#,CDPCLK4)/(DQS3R/CQ3R#,CDPCLK4)) W21(IO,_DIFFIO_R37p,_(DQ3R)/(DQ3R)/(DQ1R)) W22(IO,_DIFFIO_R37n,_(DQ3R)/(DQ3R)/(DQ1R)) Y1(IO,_DIFFIO_L32n,_(DQ3L)/(DQ3L)/(DQ1L)) Y2(IO,_DIFFIO_L32p,_(DQ3L)/(DQ3L)/(DQ1L)) Y8(IO,_DIFFIO_B11p,_(DQ5B)/(DQ3B)/(DQ5B)) Y10(IO,_DIFFIO_B22n,_(DQ5B)/(DQ3B)/(DQ5B)) Y13(IO,_DIFFIO_B28n,_(DQS4B/CQ5B,DPCLK4)/(DQS4B/CQ5B,DPCLK4)/(DQS4B/CQ5B,DPCLK4)) Y14(IO,_DIFFIO_B31p) Y15(IO,_DIFFIO_B31n) Y17(IO,_DIFFIO_B40n,_(DQS0B/CQ1B,CDPCLK3)/(DQS0B/CQ1B,CDPCLK3)/(DQS0B/CQ1B,CDPCLK3)) Y21(IO,_DIFFIO_R40p); U19 1(NC); U20 3(NC) 4(NC) 5(NC) 6(NC) 11(NC) 12(NC) 13(NC) 14(NC)

## Notes on the sheet
- ADC2接口
- ADC1接口
- ADC3接口
- FPGA主时钟
- FPGA电源控制电路
- 程序下载、固化控制电路
- 配置芯片
- (in symbol EP4CE75F23I7, part A) BANK 1
- (in symbol EP4CE75F23I7, part B) BANK 2
- (in symbol EP4CE75F23I7, part C) BANK 3
- (in symbol EP4CE75F23I7, part D) BANK 4
- (in symbol EP4CE75F23I7, part E) BANK 5
- (in symbol EP4CE75F23I7, part F) BANK 6
- (in symbol EP4CE75F23I7, part G) BANK 7
- (in symbol EP4CE75F23I7, part H) BANK 8

## Library data of the parts
C39 = CAP: Capacitor
C40-C44 C156 = C
J1 = HEADER 5X2
P9 = Header 12: Header, 12-Pin; LatestRevisionDate: 17-Jul-2002; LatestRevisionNote: Re-released for DXP Platform.; Publisher: Altium Limited
R74-R85 R136 = RES2
R88 R129-R135 = Res2: Resistor; Published: 8-Jun-2000; LatestRevisionDate: 17-Jul-2002; LatestRevisionNote: Re-released for DXP Platform.; PackageReference: AXIAL-0.4; Publisher: Altium Limited
T12 T14 T16 = TEST
U18 = EP4CE75F23I7: Cyclone IV Family FPGA, 2V Core, 292 I/O Pins, 4 PLLs, 484-Pin FBGA, Speed Grade 7, Industrial Grade; Published: 3-May-2010; DatasheetVersion: ver1.2, Mar-2010; PackageVersion: ver16.0, Dec-2009; PackageReference: FBGA484; Publisher: Altium Limited; PackageDescription: 484-Ball FineLine Ball Grid Array (FBGA484) - Flip Chip; Supplier 1: Digi-Key; Supplier Part Number 1: EP4CE75F23I7-ND; Code_JEDEC: MS-034-AAJ-1; Code_IPC: BGA100P22X22-484; ComponentLink1Description: Manufacturer Link; ComponentLink1URL: http://www.altera.com/; ComponentLink2Description: Handbook; ComponentLink2URL: http://www.altera.com/literature/hb/cyclone-iv/cyclone4-handbook.pdf; ComponentLink3Description: Pinout Specification; ComponentLink3URL: http://www.altera.com/literature/lit-dp.jsp?category=cyc%204&showspreadsheet=y; ComponentLink4Description: Packaging Specification; ComponentLink4URL: http://www.altera.com/literature/ds/dspkg.pdf
U19 = OSC